# EAGLE design POVBase (EAGLE 9.5.1)
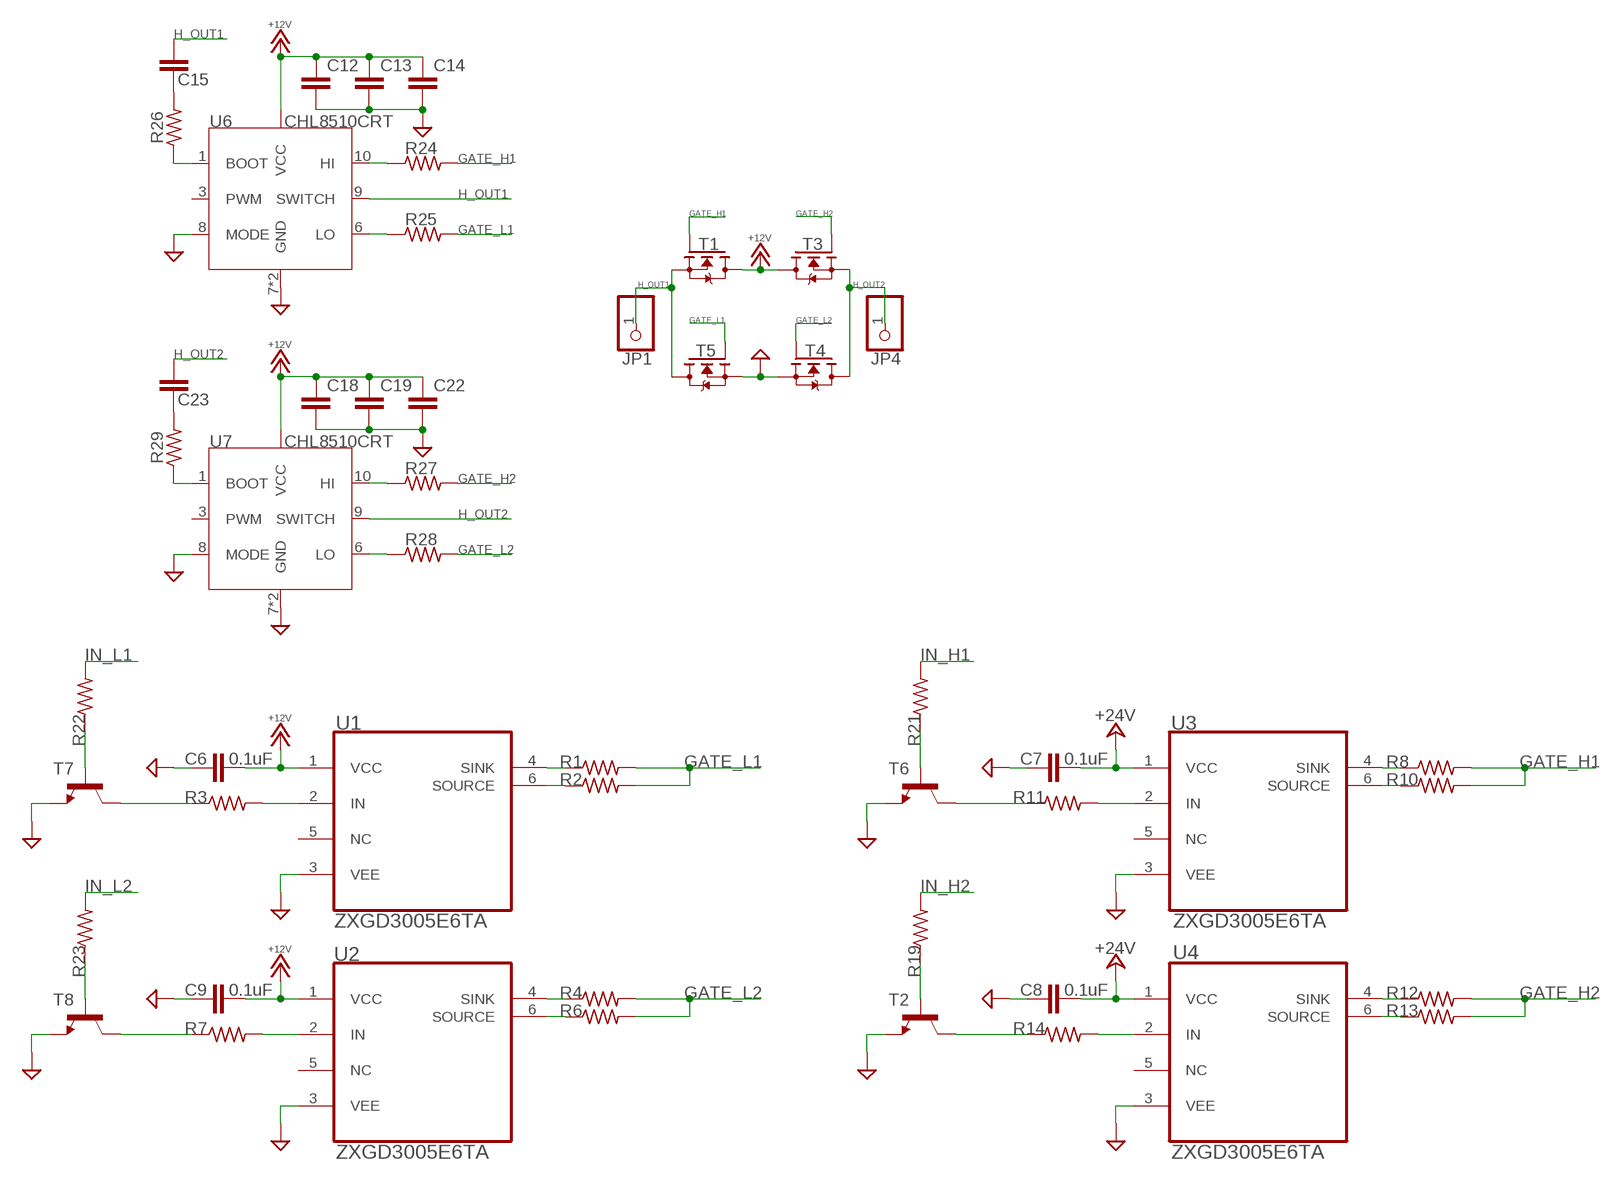
[diagram p0: schematic, sheet 1, part 1 of 2]
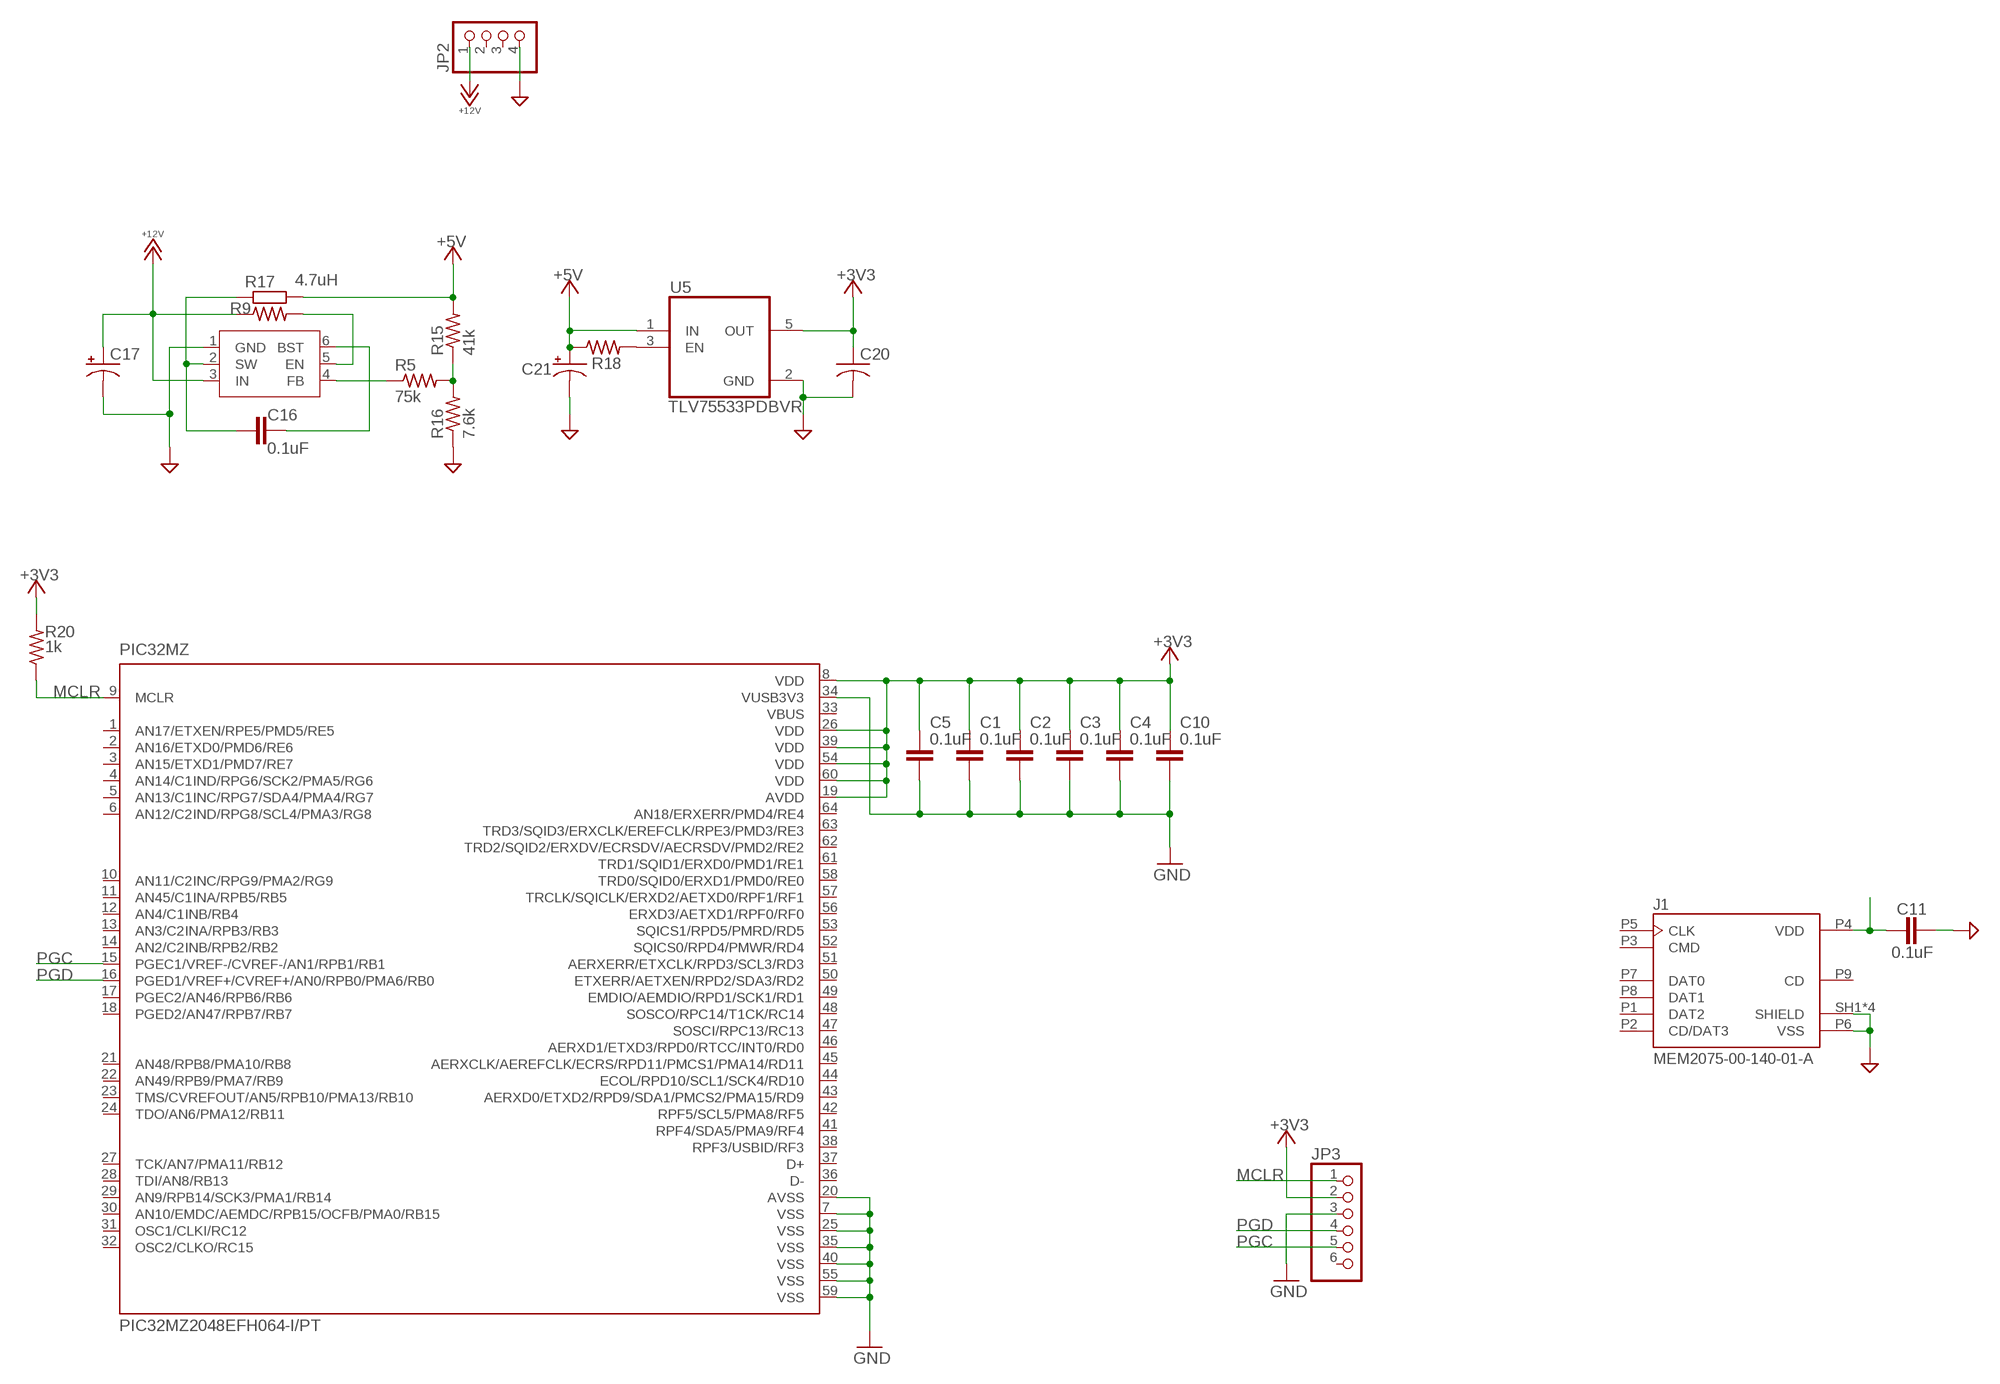
[diagram p1: schematic, sheet 1, part 2 of 2]

## Parts
C1  0.1uF  C-EUC0603  [C0603]
C2  0.1uF  C-EUC0603  [C0603]
C3  0.1uF  C-EUC0603  [C0603]
C4  0.1uF  C-EUC0603  [C0603]
C5  0.1uF  C-EUC0603  [C0603]
C6  0.1uF  C-EUC0805  [C0805]
C7  0.1uF  C-EUC0805  [C0805]
C8  0.1uF  C-EUC0805  [C0805]
C9  0.1uF  C-EUC0805  [C0805]
C10  0.1uF  C-EUC0603  [C0603]
C11  0.1uF  C-EUC0603  [C0603]
C12  C-EUC0603  [C0603]
C13  C-EUC0603  [C0603]
C14  C-EUC0603  [C0603]
C15  C-EUC0603  [C0603]
C16  0.1uF  C-EUC0603  [C0603]
C17  CPOL-USC/6032-28R  [C/6032-28R]
C18  C-EUC0603  [C0603]
C19  C-EUC0603  [C0603]
C20  C-USC0805  [C0805]
C21  CPOL-USB/3528-21W  [B/3528-21W]
C22  C-EUC0603  [C0603]
C23  C-EUC0603  [C0603]
J1  MEM2075-00-140-01-A  [GCT_MEM2075-00-140-01-A]
JP1  PINHD-1X1  [1X01]
JP2  PINHD-1X4  [1X04]
JP3  PINHD-1X6  [1X06]
JP4  PINHD-1X1  [1X01]
PIC32MZ  PIC32MZ2048EFH064-I/PT  [QFP50P1200X1200X120-64N]
R1  R-US_R1206  [R1206]
R2  R-US_R1206  [R1206]
R3  R-US_R0603  [R0603]
R4  R-US_R1206  [R1206]
R5  75k  R-US_R0603  [R0603]
R6  R-US_R1206  [R1206]
R7  R-US_R0603  [R0603]
R8  R-US_R1206  [R1206]
R9  R-US_R0603  [R0603]
R10  R-US_R1206  [R1206]
R11  R-US_R0603  [R0603]
R12  R-US_R1206  [R1206]
R13  R-US_R1206  [R1206]
R14  R-US_R0603  [R0603]
R15  41k  R-US_R0603  [R0603]
R16  7.6k  R-US_R0603  [R0603]
R17  4.7uH  R-EU_R0805  [R0805]
R18  R-US_R0603  [R0603]
R19  R-US_R0603  [R0603]
R20  1k  R-US_R0603  [R0603]
R21  R-US_R0603  [R0603]
R22  R-US_R0603  [R0603]
R23  R-US_R0603  [R0603]
R24  R-US_R1206  [R1206]
R25  R-US_R1206  [R1206]
R26  R-US_R0603  [R0603]
R27  R-US_R1206  [R1206]
R28  R-US_R1206  [R1206]
R29  R-US_R0603  [R0603]
T1  MOSFET-N-D2PAK  [D2PAK_TO263]
T2  -NPN-SOT23-EBC  [SOT23-EBC]
T3  MOSFET-N-D2PAK  [D2PAK_TO263]
T4  MOSFET-N-D2PAK  [D2PAK_TO263]
T5  MOSFET-N-D2PAK  [D2PAK_TO263]
T6  -NPN-SOT23-EBC  [SOT23-EBC]
T7  -NPN-SOT23-EBC  [SOT23-EBC]
T8  -NPN-SOT23-EBC  [SOT23-EBC]
U1  ZXGD3005E6TA  [SOT95P280X130-6N]
U2  ZXGD3005E6TA  [SOT95P280X130-6N]
U3  ZXGD3005E6TA  [SOT95P280X130-6N]
U4  ZXGD3005E6TA  [SOT95P280X130-6N]
U5  TLV75533PDBVR  [SOT95P280X145-5N]
U6  CHL8510CRT  [10-VFDFN]
U7  CHL8510CRT  [10-VFDFN]
U$2  AP65211A  [SOT95P280X140-6N]

## Nets
+3V3: C1.1 C2.1 C3.1 C4.1 C5.1 C10.1 C20.1 JP3.2 PIC32MZ.8(VDD) PIC32MZ.19(AVDD) PIC32MZ.26(VDD) PIC32MZ.39(VDD) PIC32MZ.54(VDD) PIC32MZ.60(VDD) R20.2 U5.5(OUT)
+5V: C21.+ R15.2 R17.2 R18.1 U5.1(IN)
+12V: C6.2 C9.2 C12.1 C13.1 C14.1 C17.+ C18.1 C19.1 C22.1 JP2.1 R9.1 T1.2(D) T3.2(D) U1.1(VCC) U2.1(VCC) U6.2(VCC) U6.4(VCC) U6.5(VCC) U7.2(VCC) U7.4(VCC) U7.5(VCC) U$2.3(IN)
+24V: C7.2 C8.2 U3.1(VCC) U4.1(VCC)
GATE_H1: R8.2 R10.2 R24.2 T1.1(G)
GATE_H2: R12.2 R13.2 R27.2 T3.1(G)
GATE_L1: R1.2 R2.2 R25.2 T5.1(G)
GATE_L2: R4.2 R6.2 R28.2 T4.1(G)
GND: C1.2 C2.2 C3.2 C4.2 C5.2 C6.1 C7.1 C8.1 C9.1 C10.2 C11.2 C12.2 C13.2 C14.2 C17.- C18.2 C19.2 C20.2 C21.- C22.2 J1.P6(VSS) J1.SH1(SHIELD) J1.SH2(SHIELD) J1.SH3(SHIELD) J1.SH4(SHIELD) JP2.4 JP3.3 PIC32MZ.7(VSS) PIC32MZ.20(AVSS) PIC32MZ.25(VSS) PIC32MZ.34(VUSB3V3) PIC32MZ.35(VSS) PIC32MZ.40(VSS) PIC32MZ.55(VSS) PIC32MZ.59(VSS) R16.1 T2.E T4.3(S) T5.3(S) T6.E T7.E T8.E U1.3(VEE) U2.3(VEE) U3.3(VEE) U4.3(VEE) U5.2(GND) U6.7(GND) U6.8(MODE) U6.11(GND) U7.7(GND) U7.8(MODE) U7.11(GND) U$2.1(GND)
H_OUT1: C15.1 JP1.1 T1.3(S) T5.2(D) U6.9(SWITCH)
H_OUT2: C23.1 JP4.1 T3.3(S) T4.2(D) U7.9(SWITCH)
IN_H1: R21.2
IN_H1_R: R11.1 T6.C
IN_H2: R19.2
IN_H2_R: R14.1 T2.C
IN_L1: R22.2
IN_L1_R: R3.1 T7.C
IN_L2: R23.2
IN_L2_R: R7.1 T8.C
MCLR: JP3.1 PIC32MZ.9(MCLR) R20.1
N$1: R3.2 U1.2(IN)
N$2: R1.1 U1.4(SINK)
N$3: R2.1 U1.6(SOURCE)
N$4: R4.1 U2.4(SINK)
N$5: R6.1 U2.6(SOURCE)
N$6: R7.2 U2.2(IN)
N$7: R8.1 U3.4(SINK)
N$8: R10.1 U3.6(SOURCE)
N$9: R11.2 U3.2(IN)
N$10: R12.1 U4.4(SINK)
N$11: R13.1 U4.6(SOURCE)
N$12: R9.2 U$2.5(EN)
N$13: R18.2 U5.3(EN)
N$14: R19.1 T2.B
N$15: R21.1 T6.B
N$16: C16.1 R17.1 U$2.2(SW)
N$17: C16.2 U$2.6(BST)
N$21: R5.1 U$2.4(FB)
N$22: R5.2 R15.1 R16.2
N$23: R14.2 U4.2(IN)
N$24: R22.1 T7.B
N$25: R23.1 T8.B
N$26: C11.1 J1.P4(VDD)
N$27: R25.1 U6.6(LO)
N$28: R24.1 U6.10(HI)
N$29: C15.2 R26.2
N$30: R26.1 U6.1(BOOT)
N$31: R28.1 U7.6(LO)
N$32: R27.1 U7.10(HI)
N$33: C23.2 R29.2
N$34: R29.1 U7.1(BOOT)
PGC: JP3.5 PIC32MZ.15(PGEC1/VREF-/CVREF-/AN1/RPB1/RB1)
PGD: JP3.4 PIC32MZ.16(PGED1/VREF+/CVREF+/AN0/RPB0/PMA6/RB0)
Unconnected: J1.P1(DAT2) J1.P2(CD/DAT3) J1.P3(CMD) J1.P5(CLK) J1.P7(DAT0) J1.P8(DAT1) J1.P9(CD) JP2.2 JP2.3 JP3.6 PIC32MZ.1(AN17/ETXEN/RPE5/PMD5/RE5) PIC32MZ.2(AN16/ETXD0/PMD6/RE6) PIC32MZ.3(AN15/ETXD1/PMD7/RE7) PIC32MZ.4(AN14/C1IND/RPG6/SCK2/PMA5/RG6) PIC32MZ.5(AN13/C1INC/RPG7/SDA4/PMA4/RG7) PIC32MZ.6(AN12/C2IND/RPG8/SCL4/PMA3/RG8) PIC32MZ.10(AN11/C2INC/RPG9/PMA2/RG9) PIC32MZ.11(AN45/C1INA/RPB5/RB5) PIC32MZ.12(AN4/C1INB/RB4) PIC32MZ.13(AN3/C2INA/RPB3/RB3) PIC32MZ.14(AN2/C2INB/RPB2/RB2) PIC32MZ.17(PGEC2/AN46/RPB6/RB6) PIC32MZ.18(PGED2/AN47/RPB7/RB7) PIC32MZ.21(AN48/RPB8/PMA10/RB8) PIC32MZ.22(AN49/RPB9/PMA7/RB9) PIC32MZ.23(TMS/CVREFOUT/AN5/RPB10/PMA13/RB10) PIC32MZ.24(TDO/AN6/PMA12/RB11) PIC32MZ.27(TCK/AN7/PMA11/RB12) PIC32MZ.28(TDI/AN8/RB13) PIC32MZ.29(AN9/RPB14/SCK3/PMA1/RB14) PIC32MZ.30(AN10/EMDC/AEMDC/RPB15/OCFB/PMA0/RB15) PIC32MZ.31(OSC1/CLKI/RC12) PIC32MZ.32(OSC2/CLKO/RC15) PIC32MZ.36(D-) PIC32MZ.37(D+) PIC32MZ.38(RPF3/USBID/RF3) PIC32MZ.41(RPF4/SDA5/PMA9/RF4) PIC32MZ.42(RPF5/SCL5/PMA8/RF5) PIC32MZ.43(AERXD0/ETXD2/RPD9/SDA1/PMCS2/PMA15/RD9) PIC32MZ.44(ECOL/RPD10/SCL1/SCK4/RD10) PIC32MZ.45(AERXCLK/AEREFCLK/ECRS/RPD11/PMCS1/PMA14/RD11) PIC32MZ.46(AERXD1/ETXD3/RPD0/RTCC/INT0/RD0) PIC32MZ.47(SOSCI/RPC13/RC13) PIC32MZ.48(SOSCO/RPC14/T1CK/RC14) PIC32MZ.49(EMDIO/AEMDIO/RPD1/SCK1/RD1) PIC32MZ.50(ETXERR/AETXEN/RPD2/SDA3/RD2) PIC32MZ.51(AERXERR/ETXCLK/RPD3/SCL3/RD3) PIC32MZ.52(SQICS0/RPD4/PMWR/RD4) PIC32MZ.53(SQICS1/RPD5/PMRD/RD5) PIC32MZ.56(ERXD3/AETXD1/RPF0/RF0) PIC32MZ.57(TRCLK/SQICLK/ERXD2/AETXD0/RPF1/RF1) PIC32MZ.58(TRD0/SQID0/ERXD1/PMD0/RE0) PIC32MZ.61(TRD1/SQID1/ERXD0/PMD1/RE1) PIC32MZ.62(TRD2/SQID2/ERXDV/ECRSDV/AECRSDV/PMD2/RE2) PIC32MZ.63(TRD3/SQID3/ERXCLK/EREFCLK/RPE3/PMD3/RE3) PIC32MZ.64(AN18/ERXERR/PMD4/RE4) U1.5(NC) U2.5(NC) U3.5(NC) U4.5(NC) U6.3(PWM) U7.3(PWM)

## Power pins joined to a net without a drawn wire
VBUS: PIC32MZ.33(VBUS)

## Library data of the parts
C1-C16 C18 C19 C22 C23 = rcl:C-EU: CAPACITOR, European symbol; SPICEPREFIX: C
C17 C21 = rcl:CPOL-US: POLARIZED CAPACITOR, American symbol; SPICEPREFIX: C
C20 = rcl:C-US: CAPACITOR, American symbol; SPICEPREFIX: C
J1 = MEM2075-00-140-01-A:MEM2075-00-140-01-A: Micro SD Memory Card Connector, 1.4mm Profile SMT, Push-Push, with Normally open Switch; AVAILABILITY: Unavailable; MF: Global Connector Technology; MP: MEM2075-00-140-01-A; PACKAGE: Package Analog Devices; PRICE: None
JP1 JP4 = pinhead:PINHD-1X1: PIN HEADER
JP2 = pinhead:PINHD-1X4: PIN HEADER
JP3 = pinhead:PINHD-1X6: PIN HEADER
PIC32MZ = PIC32MZ2048EFH064-I_PT:PIC32MZ2048EFH064-I/PT: PIC32MZ Series 2 MB Flash 512 kB RAM 200 MHz 32-Bit Microcontroller - TQFP-64; DESCRIPTION: PIC32MZ Series 2 MB Flash 512 kB RAM 200 MHz 32-Bit Microcontroller - TQFP-64; DIGI-KEY_PART_NUMBER: PIC32MZ2048EFH064-I/PT-ND; DIGI-KEY_PURCHASE_URL: https://www.digikey.com/product-detail/en/microchip-technology/PIC32MZ2048EFH064-I-PT/PIC32MZ2048EFH064-I-PT-ND/5323563?utm_source=snapeda&utm_medium=aggregator&utm_campaign=symbol; MF: Microchip; MP: PIC32MZ2048EFH064-I/PT; PACKAGE: TQFP-64 Microchip
R1-R16 R18-R29 = rcl:R-US_: RESISTOR, American symbol; SPICEPREFIX: R
R17 = rcl:R-EU_: RESISTOR, European symbol; SPICEPREFIX: R
T1 T3-T5 = we-transistor:MOSFET-N: N-Channel MOSFET SOT23 N-Chn MOSFET TSM3404, IRLML2502 (Vgs>=+/-20V, Vds<=20V, Id>=3A + Rds<=0.05Ohm @ Vgs=4.5V) BSS138 (Vgs>=+/-20V, Vds<=40V, Id>=0.2A + Rds<=3Ohm @ Vgs=4.5V) SOT223 Low Side Switch with Protection (Infineon) BSP76 (Vin=0...10V, Vds<=42V, Id=1.4A + Rds=0.2Ohm @ Vin=5V) BSP77 (Vin=0...10V, Vds<=42V, Id=2.2A + Rds=0.1Ohm @ Vin=5V) D²Pak Low Side Switch with Protection (Infineon) BTS117TC (Vin=0...10V, Vds<=60V, Id=3.5A + Rds=0.12Ohm @ Vin=5V) BTS133TC (Vin=0...10V, Vds<=60V, Id=7A + Rds=0.06Ohm @ Vin=5V) BTS141TC (Vin=0...10V, Vds<=60V, Id=12A + Rds=0.03Ohm @ Vin=5V) BTS3018TC (Vin=0...10V, Vds<=60V, Id=6A + Rds=0.02Ohm @ Vin=5V)
T2 T6-T8 = transistor:*-NPN-: NPN Transistror BF959 corrected 2008.03.06
U1-U4 = ZXGD3005E6TA:ZXGD3005E6TA: 25V 10A GATE DRIVER IN SOT26; DESCRIPTION: High and Low Side 10 A 25 V Surface Mount Non Inverting Gate Driver - SOT-26; DIGI-KEY_PART_NUMBER: ZXGD3005E6TADICT-ND; DIGI-KEY_PURCHASE_URL: https://www.digikey.com/product-detail/en/diodes-incorporated/ZXGD3005E6TA/ZXGD3005E6TADICT-ND/2638865?utm_source=snapeda&utm_medium=aggregator&utm_campaign=symbol; MF: Diodes Inc.; MP: ZXGD3005E6TA; PACKAGE: SOT-23-6 Diodes Inc.
U5 = TLV75533PDBVR:TLV75533PDBVR: 500mA Low-IQ Small-Size Low-Dropout (LDO) Regulator 5-SOT-23 -40 to 125; AVAILABILITY: Unavailable; DESCRIPTION: 500mA Low-IQ Small-Size Low-Dropout _LDO_ Regulator 5-SOT-23 -40 to 125; MF: Texas Instruments; MP: TLV75533PDBVR; PACKAGE: SOT-23 Texas Instruments; PRICE: None
U6 U7 = CHL8510CRT:CHL8510CRT: Dc-Dc Conv, Buck/Boost, 1mhz, Wdfn-10; AVAILABILITY: Unavailable; DESCRIPTION: Dc-Dc Conv, Buck/Boost, 1mhz, Wdfn-10; MF: Richtek USA; MP: RT6150AGQW; PACKAGE: WFDFN-10 Richtek; PRICE: None
U$2 = SOT95P280X140-6N:AP65211A

## Board
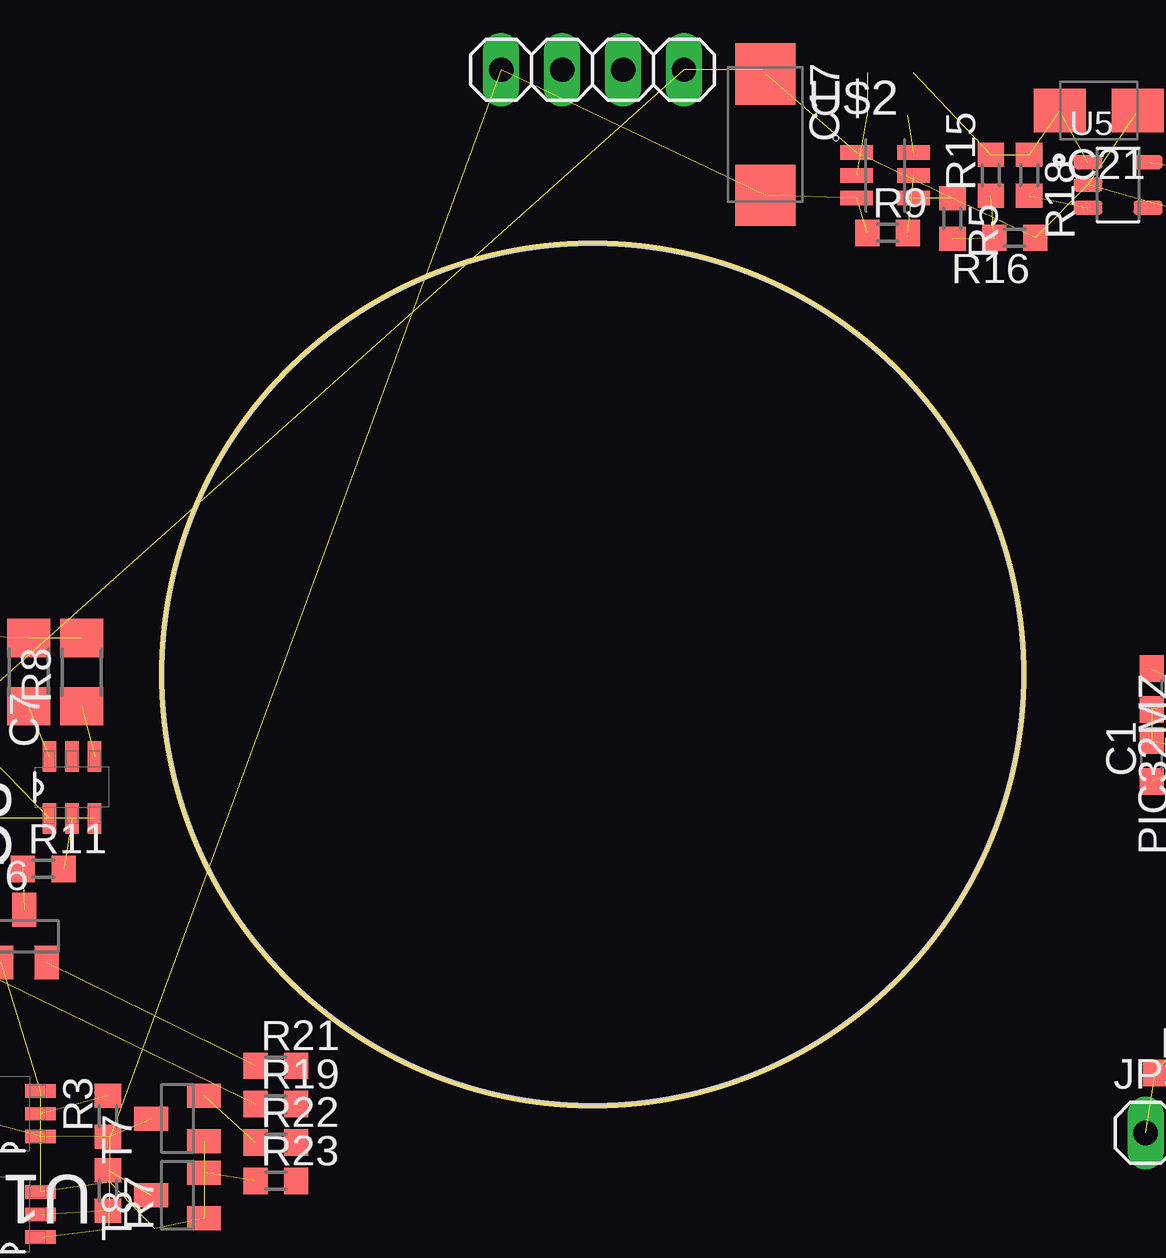
[diagram p2: board, top side]
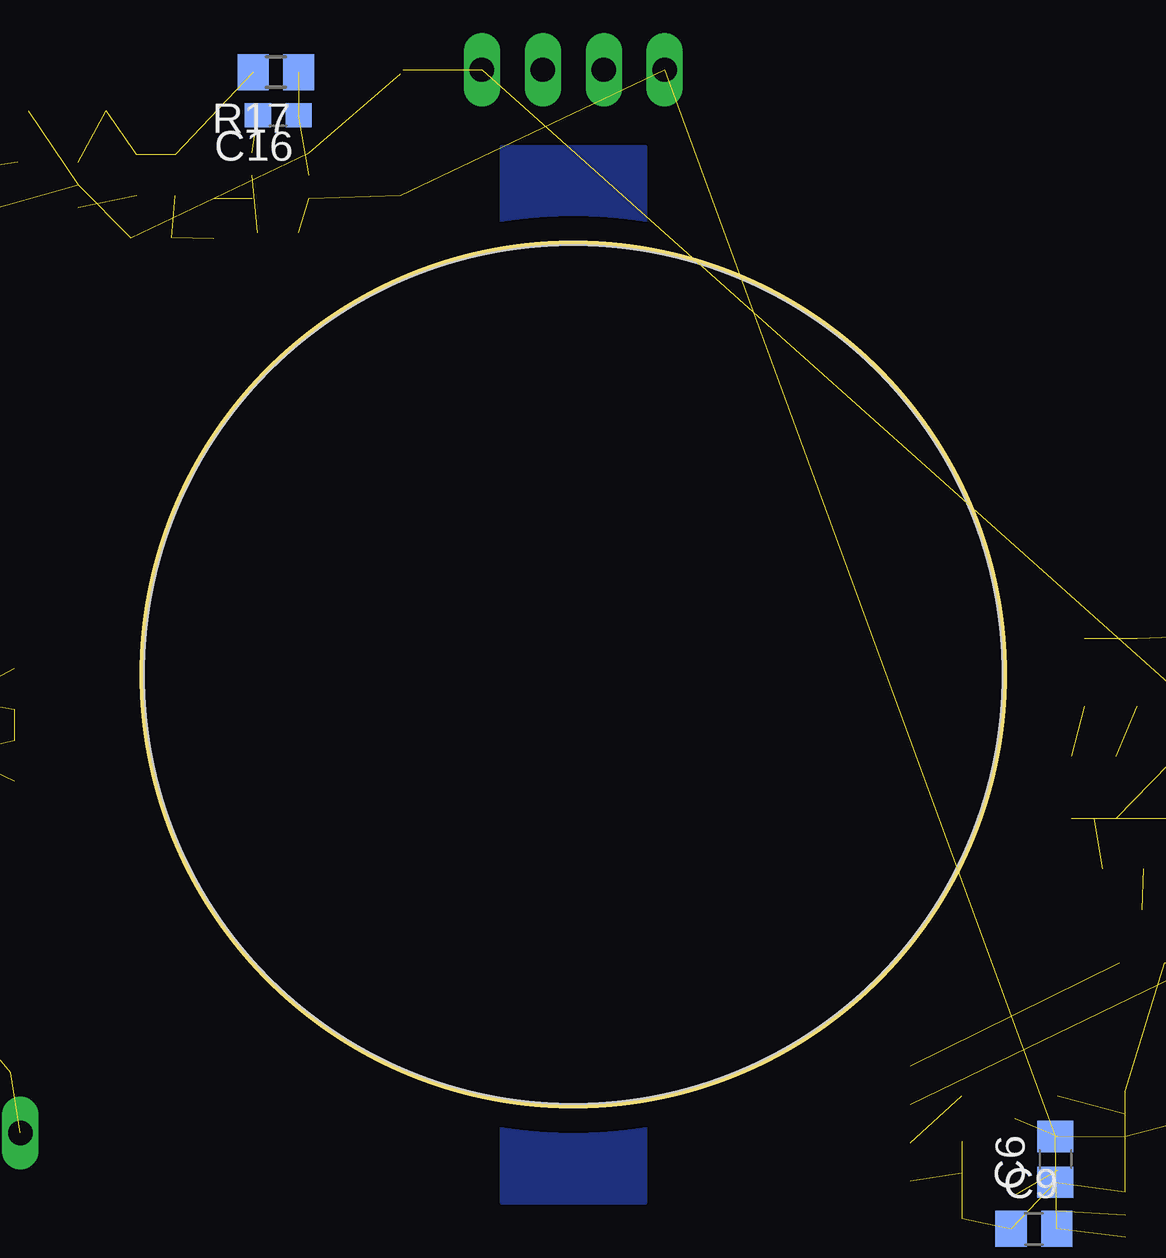
[diagram p3: board, bottom side, seen from below]

Size 36 x 36 mm. Coordinates in mm from the lower left corner, seen from the top.
Outline: circle at 18,18 radius 18
Copper layers (1+2*15+16): Top 0.035mm / dielectric 1.5mm / Route2 0.035mm / dielectric 0.15mm / Route15 0.035mm / dielectric 0.2mm / Bottom 0.035mm
Design rules "default *": minimum track width 0.1mm, minimum drill 10mil, track to track 6mil, track to pad 6mil, pad to pad 6mil, via to via 6mil, smd to smd 6mil, copper to edge 40mil, drill to drill 8mil, minimum pad ring 10mil, minimum via ring 8mil, stop-mask expansion 4mil, vias tented up to drill 0mil, thermal gap 10mil
Holes 3 mm at -78.9,69 -73.8,69.8 -81.9,63.7 -75.8,62
Holes 35.8 mm at 18,18

### Footprints (pad centres in the part's own frame; a part is rotated, then mirrored left to right if it is on the bottom)
C0603 = smd 1.1 x 1: 1 -0.85,0; 2 0.85,0
C0805 = smd 1.3 x 1.5: 1 -0.95,0; 2 0.95,0
C/6032-28R = smd 2.55 x 2.5: + 2.525,0; - -2.525,0
B/3528-21W = smd 2.15 x 1.8: + 1.625,0; - -1.625,0
GCT_MEM2075-00-140-01-A = smd 0.62 x 1.4: P1 2.58,11.42; P2 1.48,11.42; P3 0.38,11.42; P4 -0.72,11.42; P5 -1.82,11.42; P6 -2.92,11.42; P7 -4.02,11.42; P8 -5.12,11.42; P9 -6.22,11.42 | smd 1.1 x 2.4: SH1 -7.6,0.42; SH2 -7.6,9.42; SH3 8.55,9.42; SH4 8.55,0.42 | hole 0.95: -3.4,0; 3.4,0
1X01 = drill 1.016 octagon: 1 0,0
1X04 = drill 1.016 long: 1 -3.81,0; 2 -1.27,0; 3 1.27,0; 4 3.81,0
1X06 = drill 1.016 long: 1 -6.35,0; 2 -3.81,0; 3 -1.27,0; 4 1.27,0; 5 3.81,0; 6 6.35,0
QFP50P1200X1200X120-64N = smd 1.45 x 0.3: 1 -5.7,3.75; 2 -5.7,3.25; 3 -5.7,2.75; 4 -5.7,2.25; 5 -5.7,1.75; 6 -5.7,1.25; 7 -5.7,0.75; 8 -5.7,0.25; 9 -5.7,-0.25; 10 -5.7,-0.75; 11 -5.7,-1.25; 12 -5.7,-1.75; 13 -5.7,-2.25; 14 -5.7,-2.75; 15 -5.7,-3.25; 16 -5.7,-3.75; 33 5.7,-3.75; 34 5.7,-3.25; 35 5.7,-2.75; 36 5.7,-2.25; 37 5.7,-1.75; 38 5.7,-1.25; 39 5.7,-0.75; 40 5.7,-0.25; 41 5.7,0.25; 42 5.7,0.75; 43 5.7,1.25; 44 5.7,1.75; 45 5.7,2.25; 46 5.7,2.75; 47 5.7,3.25; 48 5.7,3.75 | smd 0.3 x 1.45: 17 -3.75,-5.7; 18 -3.25,-5.7; 19 -2.75,-5.7; 20 -2.25,-5.7; 21 -1.75,-5.7; 22 -1.25,-5.7; 23 -0.75,-5.7; 24 -0.25,-5.7; 25 0.25,-5.7; 26 0.75,-5.7; 27 1.25,-5.7; 28 1.75,-5.7; 29 2.25,-5.7; 30 2.75,-5.7; 31 3.25,-5.7; 32 3.75,-5.7; 49 3.75,5.7; 50 3.25,5.7; 51 2.75,5.7; 52 2.25,5.7; 53 1.75,5.7; 54 1.25,5.7; 55 0.75,5.7; 56 0.25,5.7; 57 -0.25,5.7; 58 -0.75,5.7; 59 -1.25,5.7; 60 -1.75,5.7; 61 -2.25,5.7; 62 -2.75,5.7; 63 -3.25,5.7; 64 -3.75,5.7
R1206 = smd 1.6 x 1.803: 1 -1.422,0; 2 1.422,0
R0603 = smd 1 x 1.1: 1 -0.85,0; 2 0.85,0
R0805 = smd 1.3 x 1.5: 1 -0.95,0; 2 0.95,0
D2PAK_TO263 = smd 4 x 1.6: 1 -6,2.54; 3 -6,-2.54 | smd 9.4 x 10.4: 2 3.2,0
SOT23-EBC = smd 1 x 1.4: B 0.95,-1.1; C 0,1.1; E -0.95,-1.1
SOT95P280X130-6N = smd 1.27 x 0.559: 1 -1.295,0.94; 2 -1.295,0; 3 -1.295,-0.94; 4 1.295,-0.94; 5 1.295,0; 6 1.295,0.94
SOT95P280X145-5N = smd 1.21 x 0.59: 1 -1.255,0.95; 2 -1.255,0; 3 -1.255,-0.95; 4 1.255,-0.95; 5 1.255,0.95
10-VFDFN = smd 0.74 x 0.3: 1 -1.47,1; 2 -1.47,0.5; 3 -1.47,0; 4 -1.47,-0.5; 5 -1.47,-1; 6 1.47,-1; 7 1.47,-0.5; 8 1.47,0; 9 1.47,0.5; 10 1.47,1 | smd 1.57 x 2.39: 11 0,0
SOT95P280X140-6N = smd 1.35 x 0.6: 1 -1.185,0.95; 2 -1.185,0; 3 -1.185,-0.95; 4 1.185,-0.95; 5 1.185,0; 6 1.185,0.95

### Placement (x,y rotation side)
C1  41.3,14.4 90 top  (outside the outline)
C2  47.2,8.4 180 top  (outside the outline)
C3  56.1,13.6 90 top  (outside the outline)
C4  49.2,23.5 180 top  (outside the outline)
C5  56.1,16.6 270 top  (outside the outline)
C6  -2.1,-2.2 90 bottom
C7  -7.6,16 270 top  (outside the outline)
C8  -12.7,12 90 top  (outside the outline)
C9  -1.2,-5.1 0 bottom  (outside the outline)
C10  41.3,17.4 270 top  (outside the outline)
C11  66.5,14.1 180 bottom  (outside the outline)
C12  -88,17 0 top  (outside the outline)
C13  -92,17 0 top  (outside the outline)
C14  -88,15 0 top  (outside the outline)
C15  -92,19 0 top  (outside the outline)
C16  30.3,41.3 180 bottom  (outside the outline)
C17  25.2,40.5 270 top
C18  -85,0 0 top  (outside the outline)
C19  -95,-5 0 top  (outside the outline)
C20  43.1,38.1 270 top  (outside the outline)
C21  39.1,41.5 180 top  (outside the outline)
C22  -90,-5 0 top  (outside the outline)
C23  -85,-5 0 top  (outside the outline)
J1  64.7,0.9 0 bottom  (outside the outline)
JP1  -14.9,18 0 top  (outside the outline)
JP2  18,43.2 0 top  (outside the outline)
JP3  47.4,-1.1 0 top  (outside the outline)
JP4  -27.7,18 0 top  (outside the outline)
PIC32MZ  48.7,16.1 90 top  (outside the outline)
R1  -10.9,0.9 180 top  (outside the outline)
R2  -10.9,-1.4 180 top  (outside the outline)
R3  -2.2,-0.4 90 top
R4  -10.9,-3.7 180 top  (outside the outline)
R5  33,37 270 top
R6  -10.9,-6 180 top  (outside the outline)
R7  -2.2,-3.5 270 top
R8  -3.3,18.1 90 top  (outside the outline)
R9  30.3,36.4 0 top
R10  -5.5,18.1 90 top  (outside the outline)
R11  -4.9,9.9 0 top  (outside the outline)
R12  -9.9,18.1 90 top  (outside the outline)
R13  -12.1,18.1 90 top  (outside the outline)
R14  -10.2,10 180 top  (outside the outline)
R15  34.6,38.8 90 top
R16  35.6,36.2 180 top
R17  30.4,43.1 180 bottom  (outside the outline)
R18  36.2,38.8 270 top
R19  4.8,0.1 0 top
R20  42.3,1.4 0 top  (outside the outline)
R21  4.8,1.7 0 top
R22  4.8,-1.5 0 top
R23  4.8,-3.1 0 top  (outside the outline)
R24  -91,13 90 top  (outside the outline)
R25  -94,13 90 top  (outside the outline)
R26  -88,19 0 top  (outside the outline)
R27  -94,-1 0 top  (outside the outline)
R28  -89,-1 0 top  (outside the outline)
R29  -95,-9 0 top  (outside the outline)
T1  -64,28 90 top  (outside the outline)
T2  -9.2,7.1 0 top  (outside the outline)
T3  -64,11 90 top  (outside the outline)
T4  -52,11 90 top  (outside the outline)
T5  -52,28 90 top  (outside the outline)
T6  -5.7,7.1 0 top  (outside the outline)
T7  0.7,-0.5 90 top
T8  0.7,-3.7 90 top
U1  -6.3,-0.3 180 top  (outside the outline)
U2  -6.3,-4.5 180 top  (outside the outline)
U3  -3.7,13.3 90 top
U4  -10.1,13.3 90 top  (outside the outline)
U5  39.9,38.4 0 top
U6  -81,14 0 top  (outside the outline)
U7  -94,6 0 top  (outside the outline)
U$2  30.2,38.8 0 top

### Tracks (layer width: path | path; a pad name or v marks a point on that pad's centre or on a via)
+3V3  (15 unrouted)
+5V  (4 unrouted)
+12V  (21 unrouted)
  Top 0.406: C17.+ 25.2,37.85
  pour Bottom: 21,36 21,40 15,40 15,36
+24V  (3 unrouted)
GATE_H1  (3 unrouted)
GATE_H2  (3 unrouted)
GATE_L1  (3 unrouted)
GATE_L2  (3 unrouted)
GND  (53 unrouted)
  Top 0.406: 25.1,43.2 25.27,43.02 C17.-
H_OUT1  (4 unrouted)
H_OUT2  (4 unrouted)
IN_H1_R  (1 unrouted)
IN_H2_R  (1 unrouted)
IN_L1_R  (1 unrouted)
IN_L2_R  (1 unrouted)
MCLR  (2 unrouted)
N$1  (1 unrouted)
N$2  (1 unrouted)
N$3  (1 unrouted)
N$4  (1 unrouted)
N$5  (1 unrouted)
N$6  (1 unrouted)
N$7  (1 unrouted)
N$8  (1 unrouted)
N$9  (1 unrouted)
N$10  (1 unrouted)
N$11  (1 unrouted)
N$12  (1 unrouted)
N$13  (1 unrouted)
N$14  (1 unrouted)
N$15  (1 unrouted)
N$16  (2 unrouted)
N$17  (1 unrouted)
N$20
  pour Bottom: 15,0 21,0 21,-4 15,-4
N$21  (1 unrouted)
N$22  (2 unrouted)
N$23  (1 unrouted)
N$24  (1 unrouted)
N$25  (1 unrouted)
N$26  (1 unrouted)
N$27  (1 unrouted)
N$28  (1 unrouted)
N$29  (1 unrouted)
N$30  (1 unrouted)
N$31  (1 unrouted)
N$32  (1 unrouted)
N$33  (1 unrouted)
N$34  (1 unrouted)
PGC  (1 unrouted)
PGD  (1 unrouted)